# EAGLE design adapter (EAGLE 8.0.1)
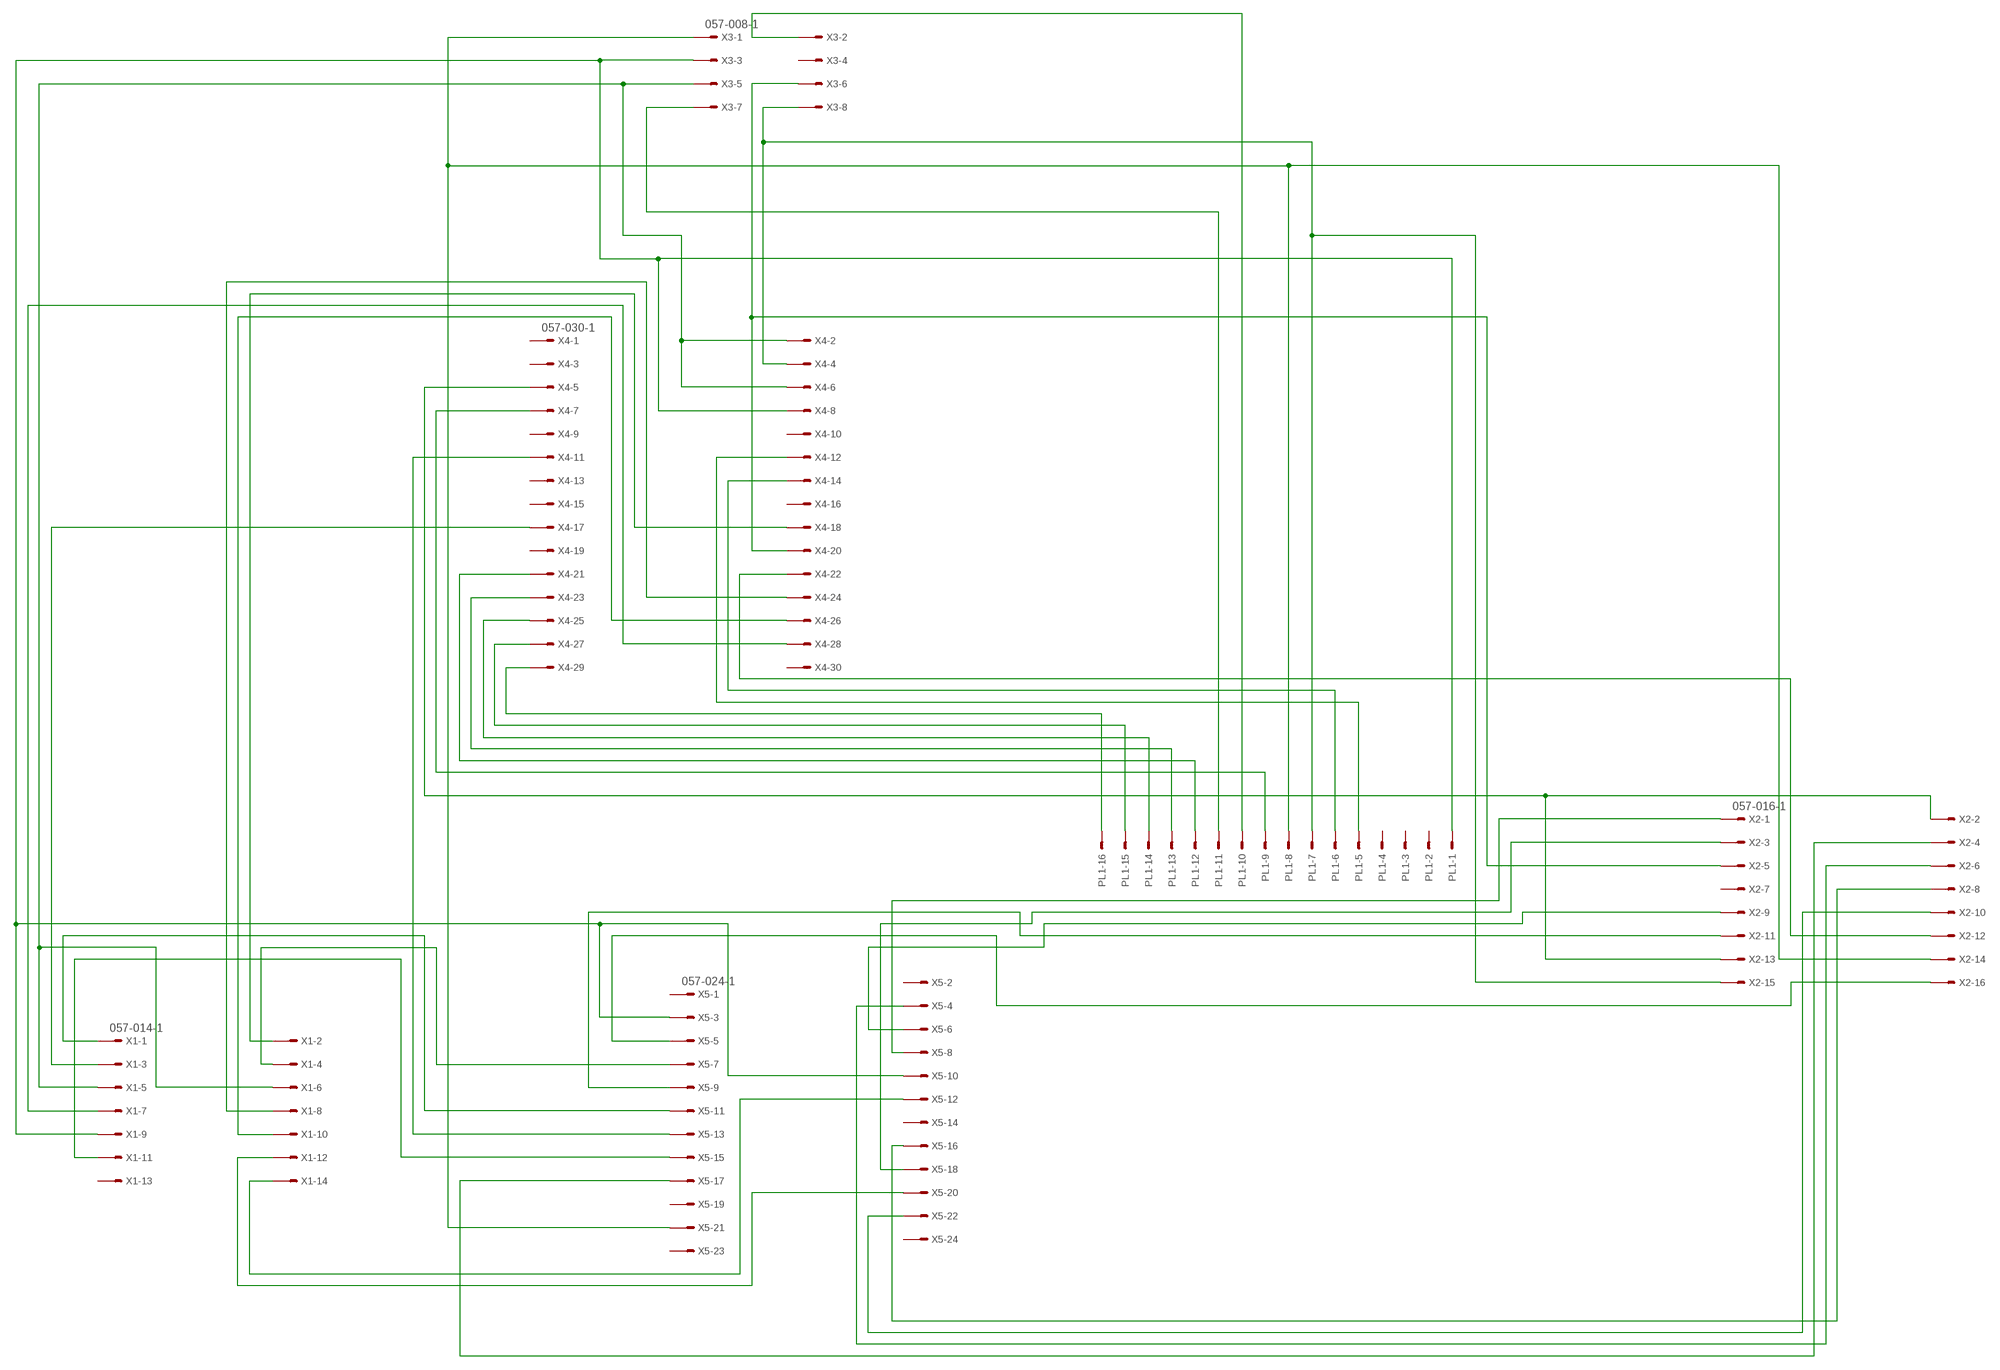
[diagram p0: schematic, sheet 1]

## Parts
PL1  555X-16V  [5566-16]
X1  057-014-1  [057-014-1]
X2  057-016-1  [057-016-1]
X3  057-008-1  [057-008-1]
X4  057-030-1  [057-030-1]
X5  057-024-1  [057-024-1]

## Nets
N$1: PL1.11 X3.7
N$2: X1.5 X1.6 X3.5 X4.2 X4.6
N$3: PL1.8 X2.14 X3.1 X5.21
N$4: PL1.7 X2.15 X3.8 X4.4
N$5: PL1.1 X1.9 X3.3 X4.8 X5.3 X5.10
N$6: X2.5 X3.6 X4.20
N$8: PL1.10 X3.2
N$9: PL1.6 X4.14
N$10: PL1.5 X4.12
N$11: PL1.16 X4.29
N$12: PL1.15 X4.27
N$13: PL1.14 X4.25
N$14: PL1.13 X4.23
N$15: PL1.12 X4.21
N$16: PL1.9 X4.7
N$17: X1.2 X4.18
N$18: X1.7 X4.28
N$19: X1.10 X4.26
N$20: X1.8 X4.24
N$21: X2.12 X4.22
N$22: X2.2 X2.13 X4.5
N$23: X4.11 X5.13
N$24: X1.3 X4.17
N$25: X1.1 X5.11
N$26: X1.4 X5.7
N$27: X1.11 X5.15
N$28: X1.12 X5.20
N$29: X1.14 X5.12
N$30: X2.16 X5.5
N$31: X2.11 X5.9
N$32: X2.1 X5.8
N$33: X2.3 X5.18
N$34: X2.9 X5.6
N$35: X2.4 X5.17
N$36: X2.6 X5.4
N$37: X2.10 X5.22
N$38: X2.8 X5.16
Unconnected: PL1.2 PL1.3 PL1.4 X1.13 X2.7 X3.4 X4.1 X4.3 X4.9 X4.10 X4.13 X4.15 X4.16 X4.19 X4.30 X5.1 X5.2 X5.14 X5.19 X5.23 X5.24

## Library data of the parts
PL1 = con-molex-2:555X-16: Mini FIT connector 16 way
X1 = con-panduit:057-014-: CONNECTOR 10-pin series 057 contact pc board low profile headers; OC_FARNELL: unknown; OC_NEWARK: unknown
X2 = con-panduit:057-016-: CONNECTOR 10-pin series 057 contact pc board low profile headers; OC_FARNELL: unknown; OC_NEWARK: unknown
X3 = con-panduit:057-008-: CONNECTOR 10-pin series 057 contact pc board low profile headers
X4 = con-panduit:057-030-: CONNECTOR 34-pin series 057 contact pc board low profile headers
X5 = con-panduit:057-024-: CONNECTOR 20-pin series 057 contact pc board low profile headers

## Board
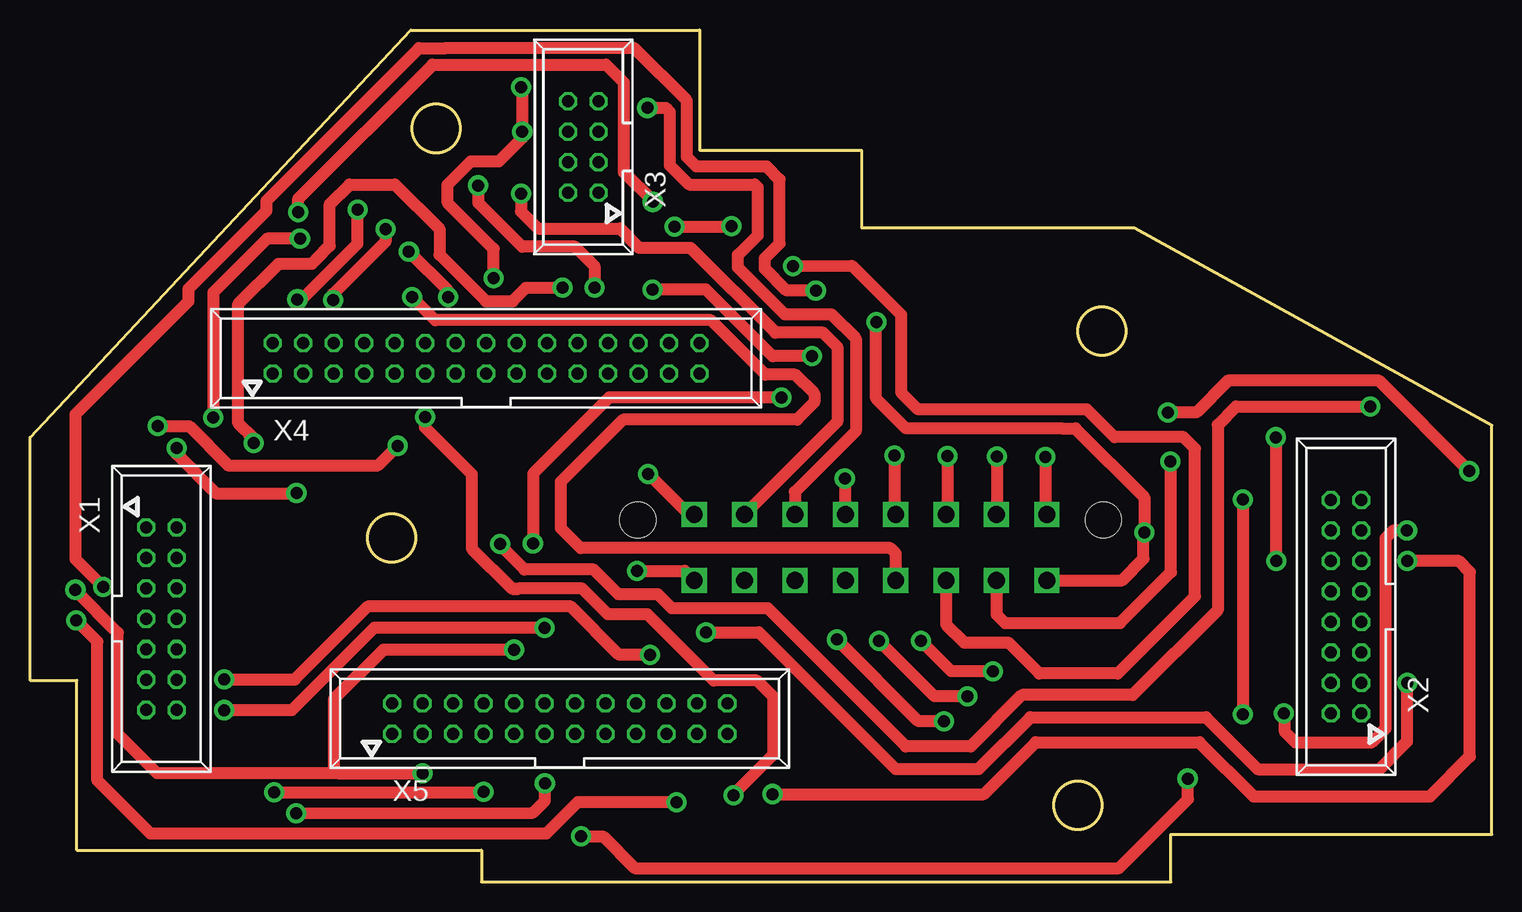
[diagram p1: board, top side]
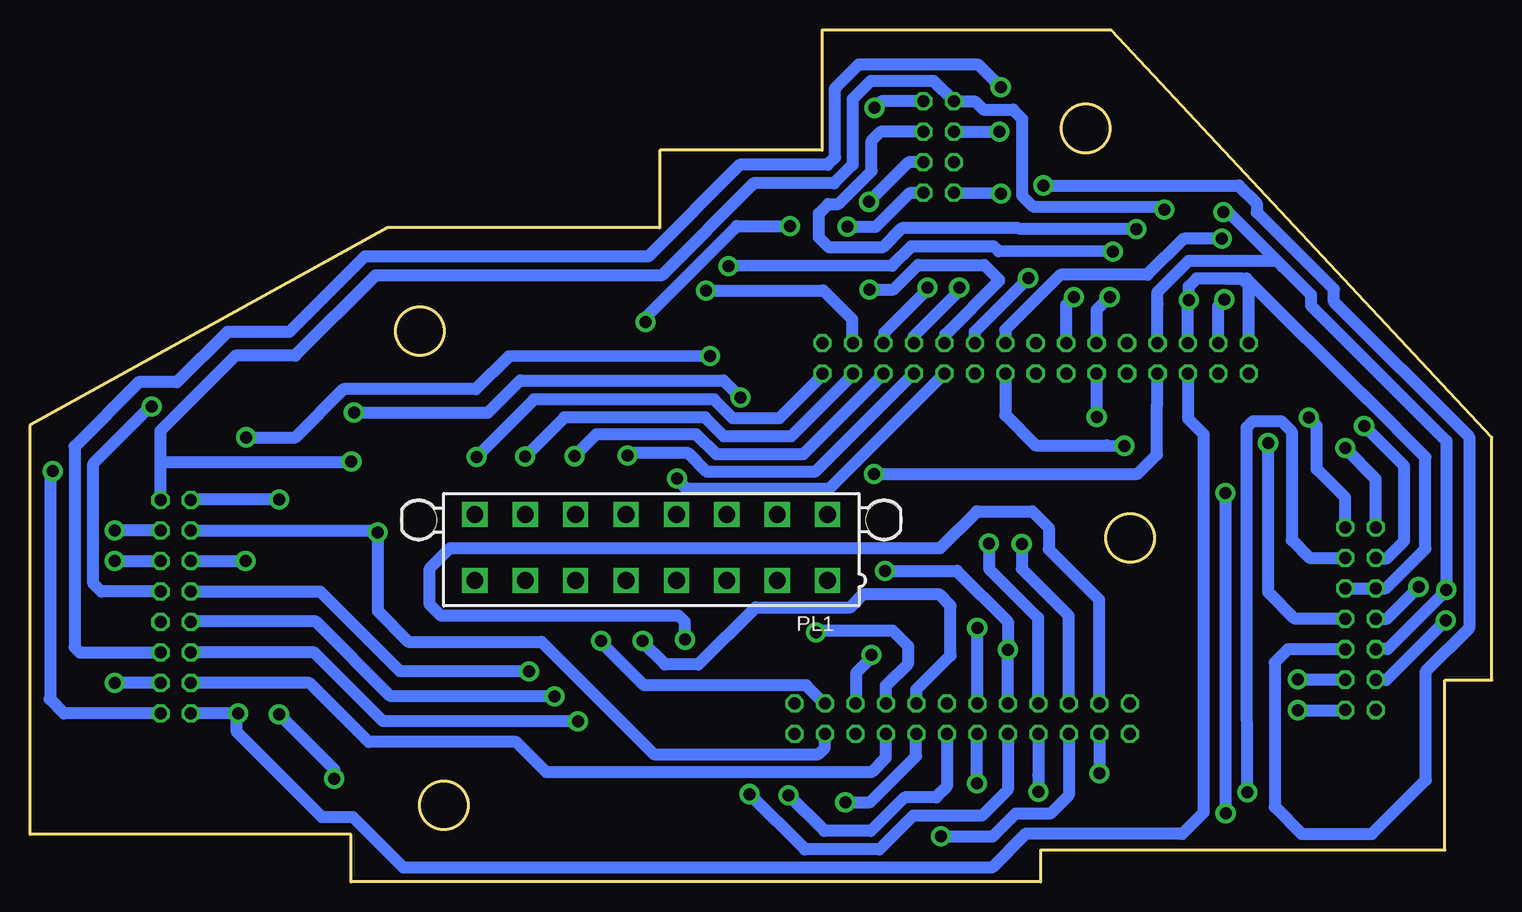
[diagram p2: board, bottom side, seen from below]

Size 121.86 x 71.03 mm. Coordinates in mm from the lower left corner, seen from the top.
Outline: 31.73,71.01 0,37.07 0,16.82 3.91,16.82 3.91,2.65 37.63,2.65
Outline: 31.77,71.02 55.81,71.02
Outline: 55.82,61 69.32,61
Outline: 55.82,71.03 55.83,71.03 55.83,60.99
Outline: 69.37,54.54 69.34,54.54 69.34,61
Outline: 69.39,54.54 92.05,54.54
Outline: 92.05,54.54 92.07,54.54
Outline: 37.63,2.64 37.63,0 95.1,0
Outline: 95.1,0 95.11,0
Outline: 95.1,0 95.1,3.96 121.86,3.96
Outline: 121.86,3.95 121.86,3.96
Outline: 121.86,3.96 121.86,38.09 92.05,54.54
Outline: circle at 89.36,45.91 radius 2
Outline: circle at 87.36,6.38 radius 2
Outline: circle at 30.15,28.68 radius 2
Outline: circle at 33.86,62.82 radius 2
Copper layers (1*16): Top 0.035mm / dielectric 1.5mm / Bottom 0.035mm
Design rules "default *": minimum track width 40mil, minimum drill 28mil, track to track 10mil, track to pad 10mil, pad to pad 8mil, via to via 10mil, smd to smd 8mil, copper to edge 10mil, drill to drill 10mil, minimum pad ring 10mil, minimum via ring 8mil, stop-mask expansion 8mil, vias tented up to drill 0mil, thermal gap 10mil

### Footprints (pad centres in the part's own frame; a part is rotated, then mirrored left to right if it is on the bottom)
5566-16 = drill 1.4 square: 1 14.7,-2.75; 2 10.5,-2.75; 3 6.3,-2.75; 4 2.1,-2.75; 5 -2.1,-2.75; 6 -6.3,-2.75; 7 -10.5,-2.75; 8 -14.7,-2.75; 9 14.7,2.75; 10 10.5,2.75; 11 6.3,2.75; 12 2.1,2.75; 13 -2.1,2.75; 14 -6.3,2.75; 15 -10.5,2.75; 16 -14.7,2.75 | hole 3: 19.4,2.29; -19.4,2.29
057-014-1 = drill 1 octagon: 1 -7.62,-1.27; 2 -7.62,1.27; 3 -5.08,-1.27; 4 -5.08,1.27; 5 -2.54,-1.27; 6 -2.54,1.27; 7 0,-1.27; 8 0,1.27; 9 2.54,-1.27; 10 2.54,1.27; 11 5.08,-1.27; 12 5.08,1.27; 13 7.62,-1.27; 14 7.62,1.27
057-016-1 = drill 1 octagon: 1 -8.89,-1.27; 2 -8.89,1.27; 3 -6.35,-1.27; 4 -6.35,1.27; 5 -3.81,-1.27; 6 -3.81,1.27; 7 -1.27,-1.27; 8 -1.27,1.27; 9 1.27,-1.27; 10 1.27,1.27; 11 3.81,-1.27; 12 3.81,1.27; 13 6.35,-1.27; 14 6.35,1.27; 15 8.89,-1.27; 16 8.89,1.27
057-008-1 = drill 1 octagon: 1 -5.08,-1.27; 2 -5.08,1.27; 3 -2.54,-1.27; 4 -2.54,1.27; 5 0,-1.27; 6 0,1.27; 7 2.54,-1.27; 8 2.54,1.27
057-030-1 = drill 1 octagon: 1 -20.32,-1.27; 2 -20.32,1.27; 3 -17.78,-1.27; 4 -17.78,1.27; 5 -15.24,-1.27; 6 -15.24,1.27; 7 -12.7,-1.27; 8 -12.7,1.27; 9 -10.16,-1.27; 10 -10.16,1.27; 11 -7.62,-1.27; 12 -7.62,1.27; 13 -5.08,-1.27; 14 -5.08,1.27; 15 -2.54,-1.27; 16 -2.54,1.27; 17 0,-1.27; 18 0,1.27; 19 2.54,-1.27; 20 2.54,1.27; 21 5.08,-1.27; 22 5.08,1.27; 23 7.62,-1.27; 24 7.62,1.27; 25 10.16,-1.27; 26 10.16,1.27; 27 12.7,-1.27; 28 12.7,1.27; 29 15.24,-1.27; 30 15.24,1.27
057-024-1 = drill 1 octagon: 1 -15.24,-1.27; 2 -15.24,1.27; 3 -12.7,-1.27; 4 -12.7,1.27; 5 -10.16,-1.27; 6 -10.16,1.27; 7 -7.62,-1.27; 8 -7.62,1.27; 9 -5.08,-1.27; 10 -5.08,1.27; 11 -2.54,-1.27; 12 -2.54,1.27; 13 0,-1.27; 14 0,1.27; 15 2.54,-1.27; 16 2.54,1.27; 17 5.08,-1.27; 18 5.08,1.27; 19 7.62,-1.27; 20 7.62,1.27; 21 10.16,-1.27; 22 10.16,1.27; 23 12.7,-1.27; 24 12.7,1.27

### Placement (x,y rotation side)
PL1  70.07,27.89 0 bottom
X1  10.95,21.94 270 top
X2  109.71,22.94 90 top
X3  46.12,62.55 90 top
X4  40.56,43.66 0 top
X5  45.43,13.61 0 top

### Tracks (layer width: path | path; a pad name or v marks a point on that pad's centre or on a via)
N$1  (via drill 1 pad 1.68)
  Top 1.016: 63.66,30.65 PL1.11 63.77,32.51 68.84,37.58 68.84,45.29 66.81,47.32 62.92,47.32 59.02,51.22 59.02,52.26 60.68,53.92 60.68,57.89 60.43,58.14 | 60.43,58.14 60.64,57.93 | 60.43,58.14 54.94,58.14 53.33,59.75 53.33,64.2 53,64.53 v51.46,64.53
  Bottom 1.016: X3.7 50.9,65.09 v51.46,64.53
N$2  (via drill 1 pad 1.68)
  Top 1.016: 25.51,48.5 v25.27,48.5 | v25.27,48.5 25.43,48.5 | v25.27,48.5 25.27,49.01 29.63,53.37 v29.63,54.43
  Bottom 1.016: X1.6 X1.5 8.84,24.48 5.54,27.78 5.54,35.39 10.39,40.24 | 10.39,40.24 11.38,41.23 | X3.5 50.96,62.55 51.71,61.8 51.71,59.27 54.47,56.51 55.31,56.51 56.09,55.73 56.09,53.73 55.25,52.89 50.8,52.89 49.2,54.49 39.44,54.49 39.43,54.48 29.68,54.48 v29.63,54.43 | 25.3,44.95 X4.6 25.32,48.45 v25.27,48.5 25.27,49.64 24.6,50.31 22.2,50.31 | 20.19,44.87 X4.2 | 22.2,50.31 20.82,50.31 20.24,49.73 X4.2 | X4.2 20.06,44.93 | 22.2,50.31 20.46,50.31 10.39,40.24
N$3  (via drill 1 pad 1.68)
  Top 1.016: v53.72,54.62 58.43,54.62 v58.49,54.68 | PL1.8 91.04,25.14 92.83,26.93 92.83,29.1 v92.88,29.15 92.88,32.09 87.16,37.81 86.02,37.81 73.04,37.81 70.54,40.31 v70.54,46.65 v70.55,46.66
  Bottom 1.016: 108.41,29.15 X2.14 93.02,29.29 v92.88,29.15 | X5.21 55.61,12.31 55.61,11.19 56.15,10.65 69.84,10.65 79.22,20.03 90.33,20.03 92.88,22.58 v92.88,29.15 | X3.1 48.5,57.47 51.35,54.62 v53.72,54.62 | v58.49,54.68 62.93,54.68 70.55,47.06 v70.55,46.66 | v92.88,29.15 92.88,26.99
N$4  (via drill 1 pad 1.68)
  Top 1.016: PL1.7 80.57,22.3 81.28,21.59 90.87,21.59 95.12,25.84 95.07,25.89 v95.07,35.05 | v27.3,56.06 27.3,53.21 22.66,48.57 v22.29,48.57
  Bottom 1.016: 110.91,31.9 X2.15 110.98,35 | 44.66,64.9 X3.8 | X3.8 46.53,66.76 51.79,66.76 53.29,65.26 53.29,59.79 54.83,58.25 61.57,58.25 61.57,58.22 69.22,50.57 93.06,50.57 99.75,43.88 104.73,43.88 110.98,37.63 110.98,35 | X3.8 43.1,65.09 42.4,64.39 39.92,64.39 39.16,63.63 39.16,57.23 38.24,56.31 27.55,56.31 v27.3,56.06 | v95.07,35.05 95.12,35 110.98,35 | X4.4 22.78,48.08 v22.29,48.57
N$5  (via drill 1 pad 1.68)
  Top 1.016: 25.64,9.06 v32.73,9.06 | 25.64,9.06 25.33,9.37 25.33,15.22 29.47,19.36 v40.35,19.36 | v3.79,24.36 3.81,24.34 3.81,24.29 7.33,20.77 7.33,12.33 10.6,9.06 25.64,9.06 | v51.92,56.7 51.92,56.74 49.52,59.14 49.52,66.65 48.02,68.15 33.55,68.15 22.37,56.97 v22.37,55.85 | v50.6,25.93 54.58,25.93 PL1.1
  Bottom 1.016: X5.10 v40.35,19.36 40.35,21.71 44.57,25.93 v50.6,25.93 | X5.3 v32.73,9.06 v32.74,9.05 | X1.9 9.66,19.42 8.68,19.42 3.79,24.31 v3.79,24.36 3.79,36.77 15.08,48.06 15.08,48.95 17.05,50.91 | 27.86,48.19 X4.8 27.88,44.94 27.88,49.18 25.26,51.8 17.93,51.8 | X3.3 48.61,60.01 v51.92,56.7 51.94,56.68 | 17.05,50.91 17.43,51.3 17.66,51.53 | v22.37,55.85 21.98,55.85 17.93,51.8 | 17.93,51.8 17.05,50.91
N$6  (via drill 1 pad 1.68)
  Top 1.016: 38.54,50.33 v38.65,50.33 38.65,52.77 34.82,56.6 34.82,58.08 34.79,58.11 36.74,60.06 39.08,60.06 41.04,62.02 v41.04,62.56 41.04,66.16 v40.94,66.26
  Bottom 1.016: 44.84,62.53 X3.6 41.05,62.55 v41.04,62.56 | 43.13,44.95 X4.20 43.1,45.88 v38.65,50.33 | X2.5 117.71,19.13 118.15,19.57 118.15,36.31 112.8,41.66 109.6,41.66 105.4,45.86 100.24,45.86 93.95,52.15 70.33,52.15 62.7,59.78 55.37,59.78 54.75,60.4 54.75,66.21 54.71,66.21 52.76,68.16 42.84,68.16 v40.94,66.26
N$8  (via drill 1 pad 1.68)
  Top 1.016: 40.9,57.37 v40.93,57.4 40.93,55.9 42.35,54.48 49.17,54.48 50.79,52.86 55.06,52.86 62.13,45.79 66.12,45.79 67.31,44.6 67.31,38.38 PL1.10 59.57,31.09
  Bottom 1.016: 44.88,57.44 X3.2 44.82,57.43 v40.93,57.4
N$9  (via drill 1 pad 1.68)
  Top 1.016: PL1.6 76.37,21.48 77.89,19.96 81.55,19.96 84.14,17.37 90.67,17.37 97.12,23.82 97.12,36.13 96.16,37.09 90.4,37.09 88.1,39.39 74.03,39.39 72.61,40.81 72.61,47.28 68.52,51.37 v63.62,51.35 | v34.84,48.75 34.84,49.3 v31.58,52.56
  Bottom 1.016: v63.62,51.35 50,51.37 48.39,52.98 41.51,52.98 41.11,52.58 v31.58,52.56 | X4.14 35.48,48.11 v34.84,48.75
N$10  (via drill 1 pad 1.68)
  Top 1.016: PL1.5 72.17,27.38 71.71,27.84 45.91,27.84 44.27,29.48 44.27,33.37 49.45,38.55 63.94,38.55 65.38,39.99 65.38,40.7 63.79,42.29 61.31,42.29 56.76,46.84 33.78,46.84 v31.86,48.76
  Bottom 1.016: v31.86,48.76 v31.87,48.76 32.95,47.68 X4.12
N$11  (via drill 1 pad 1.68)
  Top 1.016: v84.64,35.43 84.64,30.77 PL1.16
  Bottom 1.016: X4.29 55.91,42.15 59.41,38.65 63.26,38.65 64.83,40.22 79.85,40.22 v84.64,35.43
N$12  (via drill 1 pad 1.68)
  Top 1.016: v80.6,35.46 80.6,30.67 PL1.15
  Bottom 1.016: X4.27 53.41,42.15 58.41,37.15 64.01,37.15 65.58,38.72 77.3,38.72 80.58,35.44 v80.6,35.46
N$13  (via drill 1 pad 1.68)
  Top 1.016: v76.48,35.49 76.48,30.75 PL1.14
  Bottom 1.016: X4.25 50.91,42.15 57.41,35.65 64.65,35.65 66.32,37.32 74.66,37.32 76.4,35.58 76.4,35.57 v76.48,35.49
N$14  (via drill 1 pad 1.68)
  Top 1.016: v72.06,35.54 72.06,30.75 PL1.13
  Bottom 1.016: 48.41,42.15 X4.23 48.23,42.39 56.44,34.18 65.41,34.18 66.98,35.75 71.85,35.75 v72.06,35.54 | v72.06,35.54 72.14,35.46 v72.06,35.54
N$15  (via drill 1 pad 1.68)
  Top 1.016: 67.87,30.74 PL1.12 67.97,33.58 v67.92,33.63
  Bottom 1.016: X4.21 55.25,32.78 67.07,32.78 v67.92,33.63
N$16  (via drill 1 pad 1.68)
  Top 1.016: PL1.9 54.95,30.64 51.58,34.01 v51.52,34.01
  Bottom 1.016: X4.7 27.9,42.35 27.9,39.8 27.91,39.79 27.91,35.63 29.53,34.01 v51.52,34.01
N$17  (via drill 1 pad 1.68)
  Top 1.016: v15.26,38.72 15.28,38.74 15.28,49.15 19.76,53.63 v22.5,53.63
  Bottom 1.016: X1.2 12.22,32.05 14.59,34.42 14.59,38.05 v15.26,38.72 | X4.18 40.55,46.03 35.96,50.62 28.7,50.62 25.69,53.63 v22.5,53.63
N$18  (via drill 1 pad 1.68)
  Top 1.016: v6.11,24.58 3.8,26.89 3.8,39 13.21,48.41 13.21,49.46 19.71,55.96 19.71,56.79 32.43,69.51 34.67,69.51 34.69,69.53 50.35,69.53 54.75,65.13 54.75,60.44 55.55,59.64 61.42,59.64 62.49,58.57 62.49,53.22 61.26,51.99 61.26,51.12 63.07,49.31 v65.5,49.31
  Bottom 1.016: v6.11,24.58 8.75,21.94 X1.7 | 53.26,45.02 X4.28 53.33,44.99 53.33,46.92 55.72,49.31 v65.5,49.31 65.59,49.47
N$19  (via drill 1 pad 1.68)
  Top 1.016: 37.4,58.04 v37.37,58.07 37.39,58.05 37.39,56.6 41.03,52.96 45.45,52.96 47.05,51.36 v47.05,49.57 v47.06,49.56
  Bottom 1.016: X1.10 16.99,19.4 18.11,18.28 18.11,6.24 15.87,4 9.99,4 5.5,8.49 5.5,17.58 1.86,21.22 1.86,37.05 13.17,48.36 13.17,49.41 19.59,55.83 19.59,56.59 21.07,58.07 v37.37,58.07 | v47.06,49.56 47.06,49.38 50.67,45.77 50.67,44.98 X4.26
N$20  (via drill 1 pad 1.68)
  Top 1.016: 18.68,36.92 v18.65,36.6 | 18.27,37.3 v18.65,36.6 | v44.4,49.54 v44.39,49.53 41.34,49.53 40.23,48.42 38.01,48.42 34.13,52.3 34.13,54.45 30.43,58.15 26.63,58.15 24.99,56.51 24.99,53.04 23.89,51.95 23.49,51.54 20.71,51.54 17.37,48.2 17.37,38.23 18.65,36.95 v18.65,36.6
  Bottom 1.016: X1.8 16.42,21.94 18.64,24.16 18.64,36.85 v18.65,36.6 | v44.4,49.54 44.4,49.29 48.21,45.48 48.21,44.95 X4.24
N$21  (via drill 1 pad 1.68)
  Top 1.016: v103.9,26.77 103.9,37.01 v103.84,37.07 | v51.88,49.4 56.35,49.4 61.91,43.84 v65.18,43.84
  Bottom 1.016: X2.12 103.92,26.75 v103.9,26.77 | v103.84,37.07 99.73,37.07 95.72,41.08 84.68,41.08 81.94,43.82 v65.18,43.84 | v51.88,49.4 49.87,49.4 47.83,51.44 42.31,51.44 41.07,50.2 41.07,50.13 45.56,45.64 45.56,45.01 X4.22
N$22  (via drill 1 pad 1.68)
  Top 1.016: v114.79,29.3 113.64,29.3 112.99,28.65 112.99,12.79 111.8,11.6 105.52,11.6 104.62,12.5 104.62,14 104.57,14.05 v104.51,14.05
  Bottom 1.016: 25.41,42.15 X4.5 25.3,42.36 25.3,38.6 24.02,37.32 24.02,5.79 25.81,4 38.91,4 38.91,3.96 41.68,1.19 90.72,1.19 94.93,5.4 97.52,5.4 104.62,12.5 104.62,13.94 v104.51,14.05 X2.2 108.41,14.15 | 111.16,29.15 X2.13 114.71,29.29 114.73,29.27 114.76,29.27 v114.79,29.3
N$23  (via drill 1 pad 1.68)
  Top 1.016: 40.72,24.45 40.2,24.45 36.83,27.82 36.83,33.99 32.93,37.89 32.93,38.15 32.94,38.16 v32.94,38.76 | v58.63,7.23 58.63,7.31 61.93,10.61 61.92,10.62 61.92,15.47 60.59,16.8 56.98,16.8 51.46,22.32 48.17,22.32 46.04,24.45 40.72,24.45 | 40.72,24.45 40.71,24.44 40.2,24.44
  Bottom 1.016: X4.11 v32.94,38.76 | X5.13 45.43,7.94 46.33,7.04 48.96,7.04 51.76,4.24 55.64,4.24 v58.63,7.23
N$24  (via drill 1 pad 1.68)
  Top 1.016: v10.65,38 13.25,38 16.52,34.73 29,34.73 v30.63,36.36
  Bottom 1.016: X4.17 40.56,38.91 38.05,36.4 32.06,36.4 v30.63,36.36 | X1.3 9.6,26.94 8.81,26.94 7.31,28.44 7.31,34.66 v10.65,38
N$25  (via drill 1 pad 1.68)
  Top 1.016: v22.19,5.73 41.92,5.78 42.92,6.78 v42.92,8.21 | v12.22,36.18 12.22,35.66 15.48,32.4 21.98,32.4 v22.21,32.42
  Bottom 1.016: 9.91,29.65 X1.1 9.68,33.61 12.19,36.12 12.19,36.15 v12.22,36.18 | v42.92,8.21 42.92,12.3 X5.11 | v22.21,32.42 22.21,5.75 v22.19,5.73
N$26  (via drill 1 pad 1.68)
  Top 1.016: v20.37,7.46 37.76,7.46 v37.8,7.5
  Bottom 1.016: X5.7 37.81,8.92 | 37.81,8.92 37.83,8.9 | 37.81,8.92 v37.8,7.5 | v20.37,7.46 20.43,19.29 20.43,37.9 19.92,38.41 17.56,38.41 16.69,37.54 16.69,28.5 15.2,27.01 X1.4
N$27  (via drill 1 pad 1.68)
  Top 1.016: v3.85,21.81 5.61,20.05 5.61,8.45 10.05,4.01 43.03,4.01 45.66,6.64 v53.9,6.64
  Bottom 1.016: v3.85,21.81 3.85,21.79 8.8,16.84 9.66,16.84 X1.11 | v53.9,6.64 51.83,6.64 48,10.47 48,12.3 X5.15
N$28  (via drill 1 pad 1.68)
  Top 1.016: v16.18,16.87 22.08,16.87 28.16,22.95 45.09,22.95 49.11,18.93 v51.7,18.93
  Bottom 1.016: X1.12 16.13,16.86 16.15,16.84 v16.18,16.87 | v51.7,18.93 51.7,18.71 52.99,17.42 52.99,14.93 X5.20
N$29  (via drill 1 pad 1.68)
  Top 1.016: v16.18,14.32 16.21,14.29 16.24,14.29 16.27,14.32 21.83,14.32 28.69,21.18 v42.9,21.18
  Bottom 1.016: X5.12 42.89,20.94 42.9,20.95 v42.9,21.18 | v16.18,14.32 X1.14
N$30  (via drill 1 pad 1.68)
  Top 1.016: v101.11,13.98 v101.1,13.99 v101.1,31.87 | v45.93,3.79 47.77,3.79 50.41,1.15 90.79,1.15 96.54,6.9 96.54,8.57 v96.5,8.61
  Bottom 1.016: 35.41,12.15 X5.5 35.27,7.23 36.81,5.69 39.7,5.69 41.63,3.76 45.9,3.76 v45.93,3.79 | v101.1,31.87 108.4,31.87 X2.16 | v96.5,8.61 96.5,9.37 v101.11,13.98
N$31  (via drill 1 pad 1.68)
  Top 1.016: v114.8,26.75 119.13,26.75 120.04,25.84 120.04,10.46 116.71,7.13 102.01,7.13 97.49,11.65 83.85,11.65 79.52,7.32 v61.89,7.32
  Bottom 1.016: 111.16,26.65 X2.11 v114.8,26.75 | X5.9 40.35,7.69 42.52,5.52 48.24,5.52 51.06,2.7 57.27,2.7 v61.89,7.32
N$32  (via drill 1 pad 1.68)
  Top 1.016: v119.97,34.24 119.97,34.28 112.47,41.78 99.85,41.78 97.21,39.14 v94.87,39.14 v94.86,39.13 | v41.92,28.21 41.94,28.23 41.94,34.05 48.29,40.4 v62.64,40.4
  Bottom 1.016: v41.92,28.21 41.92,26.11 37.83,22.02 37.83,14.9 X5.8 | v119.97,34.24 120.19,34.02 120.19,15.29 120.23,15.25 119.03,14.05 X2.1 | v94.86,39.13 83.68,39.13 80.99,41.82 64.06,41.82 v62.64,40.4
N$33  (via drill 1 pad 1.68)
  Top 1.016: v114.81,16.58 114.81,11.7 112.51,9.4 102.35,9.4 98.03,13.72 83.39,13.72 79.08,9.41 72.15,9.41 60.75,20.81 v56.35,20.81
  Bottom 1.016: X2.3 114.96,16.59 115,16.55 114.84,16.55 v114.81,16.58 | X5.18 50.51,16.36 48.65,18.22 48.65,19.64 49.94,20.93 56.23,20.93 v56.35,20.81
N$34  (via drill 1 pad 1.68)
  Top 1.016: v39.19,28.17 39.19,28.08 41.22,26.05 46.98,26.05 49.03,24 52.33,24 53.49,22.84 61.48,22.84 73.02,11.3 78.42,11.3 82.7,15.59 91.94,15.59 99,22.65 99,38.1 100.54,39.64 v111.72,39.64
  Bottom 1.016: 111.16,24.15 X2.9 115.91,24.21 116.58,24.88 116.58,34.88 111.82,39.64 v111.72,39.64 | v39.19,28.17 39.19,26.11 35.28,22.2 35.28,14.89 X5.6
N$35
  Bottom 1.016: X5.17 50.51,10.37 51.73,9.15 78.81,9.15 81.32,11.66 93.62,11.66 98.55,16.59 X2.4
N$36  (via drill 1 pad 1.68)
  Top 1.016: v76.19,13.39 74.08,13.39 v67.27,20.2
  Bottom 1.016: X2.6 98.16,19.13 92.42,13.39 v76.19,13.39 | 67.24,20.17 v67.27,20.2 67.27,21.69 67.76,22.18 87.58,22.18 88.53,23.13 88.53,26.13 86.82,27.84 45.99,27.84 42.94,30.89 38.3,30.89 36.93,29.52 36.93,27.73 32.73,23.53 X5.4 32.93,15.08
N$37  (via drill 1 pad 1.68)
  Top 1.016: 74.51,20.1 v74.27,20.1 76.81,17.56 v80.26,17.56
  Bottom 1.016: X5.22 55.66,14.9 57.16,16.4 70.66,16.4 74.29,20.03 74.29,20.08 v74.27,20.1 | v80.26,17.56 80.28,17.58 91.04,17.58 97.67,24.21 X2.10
N$38  (via drill 1 pad 1.68)
  Top 1.016: 70.95,20.1 v70.78,20.1 75.4,15.48 v78.14,15.48
  Bottom 1.016: 48.16,14.9 X5.16 47.97,16.03 45.12,18.88 45.12,23 46.11,23.99 49.36,23.99 52.37,23.99 53.46,22.9 61.38,22.9 66.16,18.12 68.94,18.12 70.88,20.06 70.82,20.06 v70.78,20.1 | X2.8 108.41,21.7 98.01,21.7 91.79,15.48 v78.14,15.48